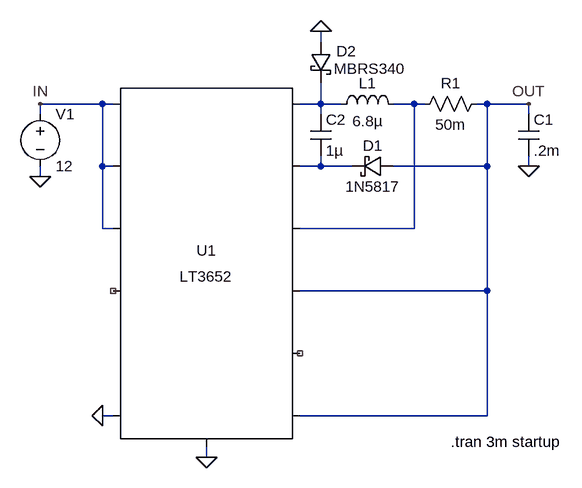
[diagram p0: schematic 3652.asc]
3652.asc, the LTspice schematic file:
Version 4
SHEET 1 896 680
WIRE 400 -160 400 -176
WIRE 64 -64 -32 -64
WIRE 80 -64 64 -64
WIRE 400 -64 400 -96
WIRE 400 -64 368 -64
WIRE 432 -64 400 -64
WIRE 544 -64 512 -64
WIRE 560 -64 544 -64
WIRE 656 -64 640 -64
WIRE 720 -64 656 -64
WIRE -32 -48 -32 -64
WIRE 400 -48 400 -64
WIRE 720 -48 720 -64
WIRE 64 32 64 -64
WIRE 80 32 64 32
WIRE 400 32 400 16
WIRE 400 32 368 32
WIRE 448 32 400 32
WIRE 656 32 656 -64
WIRE 656 32 512 32
WIRE 720 32 720 16
WIRE -32 48 -32 32
WIRE 64 128 64 32
WIRE 80 128 64 128
WIRE 544 128 544 -64
WIRE 544 128 368 128
WIRE 656 224 656 32
WIRE 656 224 368 224
WIRE 80 416 64 416
WIRE 656 416 656 224
WIRE 656 416 368 416
WIRE 224 480 224 464
FLAG 224 480 0
FLAG 64 416 0
FLAG -32 48 0
FLAG 720 32 0
FLAG -32 -64 IN
FLAG 720 -64 OUT
FLAG 400 -176 0
SYMBOL PowerProducts\\LT3652 224 176 R0
SYMATTR InstName U1
SYMBOL voltage -32 -64 R0
SYMATTR InstName V1
SYMATTR Value 12
SYMBOL ind 416 -48 R270
WINDOW 0 32 56 VTop 2
WINDOW 3 5 56 VBottom 2
SYMATTR InstName L1
SYMATTR Value 6.8µ
SYMATTR SpiceLine Rpar=10K
SYMBOL res 544 -48 R270
WINDOW 0 32 56 VTop 2
WINDOW 3 0 56 VBottom 2
SYMATTR InstName R1
SYMATTR Value 50m
SYMBOL cap 704 -48 R0
SYMATTR InstName C1
SYMATTR Value .2m
SYMBOL cap 384 -48 R0
SYMATTR InstName C2
SYMATTR Value 1µ
SYMBOL schottky 512 16 R90
WINDOW 0 0 32 VBottom 2
WINDOW 3 32 32 VTop 2
SYMATTR InstName D1
SYMATTR Value 1N5817
SYMATTR Description Diode
SYMATTR Type diode
SYMBOL schottky 384 -160 R0
WINDOW 3 36 42 Left 2
WINDOW 0 40 15 Left 2
SYMATTR Value MBRS340
SYMATTR InstName D2
SYMATTR Description Diode
SYMATTR Type diode
TEXT 600 456 Left 2 !.tran 3m startup

The netlist it stands for:
* 3652.asc
XU1 IN IN IN NC_01 NC_02 0 OUT NC_03 OUT N002 N003 N001 0 LT3652
V1 IN 0 12
L1 N001 N002 6.8µ Rpar=10K
R1 N002 OUT 50m
C1 OUT 0 .2m
C2 N001 N003 1µ
D1 OUT N003 1N5817
D2 0 N001 MBRS340
.model D D
.lib standard.dio
.tran 3m startup
.lib LT3652.sub
.backanno
.end